# Altium schematic sheet CAN.SchDoc
size A4; SheetNumber: 2; SheetTotal: 9
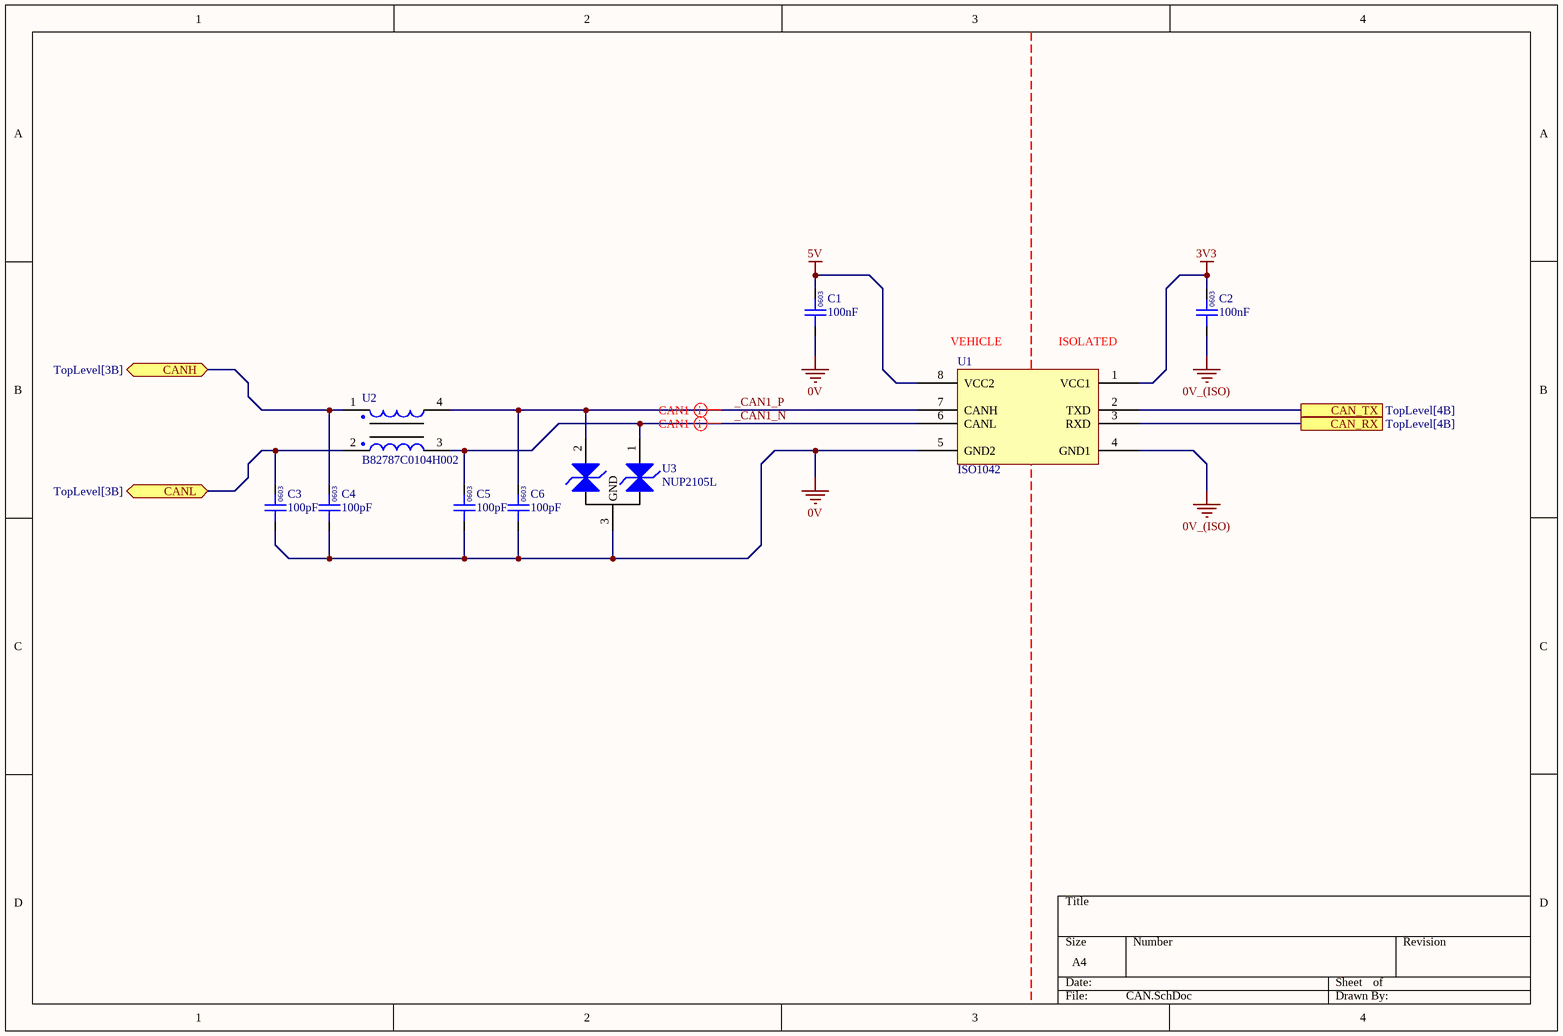
[diagram p0: CAN.SchDoc]

## Parts
C1  100nF  [0603]
C2  100nF  [0603]
C3  100pF  [0603]
C4  100pF  [0603]
C5  100pF  [0603]
C6  100pF  [0603]
U1  ISO1042  [TI-SOIC-8]
U2  B82787C0104H002  [TDK 4-PC Pad]
U3  NUP2105L  [ON SOT-23]

## Ports
CAN_RX (see TopLevel[4B]), CAN_TX (see TopLevel[4B]), CANH (bidir, see TopLevel[3B]), CANL (bidir, see TopLevel[3B])

## Nets
0V: C1.1 C3.1 C4.1 C5.1 C6.1 U1.5(GND2) U3.3(GND)
0V_(ISO): C2.1 U1.4(GND1)
3V3: C2.2 U1.1(VCC1)
5V: C1.2 U1.8(VCC2)
_CAN1_N: C5.2 U1.6(CANL) U2.3 U3.1(CAN_H)
_CAN1_P: C6.2 U1.7(CANH) U2.4 U3.2(CAN_L)
CAN_RX: U1.3(RXD) ; port CAN_RX
CAN_TX: U1.2(TXD) ; port CAN_TX
CANH: C4.2 U2.1 ; port CANH
CANL: C3.2 U2.2 ; port CANL

## Layout directives
differential pair: _CAN1_N, _CAN1_P

## Notes on the sheet
- (near U1) VEHICLE
- (near U1) ISOLATED
- (in symbol GCM188L81H104KA57D) 0603
- (in symbol GRM1885C1H101JA01D) 0603

## Library data of the parts
C1 C2 = GCM188L81H104KA57D: Manufacturer: muRata; Rated Voltage: 50V; Tolerance: ±10%; Material: MLCC; Temperature Rating: X8L; Part Number: GCM188L81H104KA57D; Value: 100nF; Digikey Part Number: 490-6049-1-ND
C3-C6 = GRM1885C1H101JA01D: Manufacturer: Murata Electronics; Rated Voltage: 50V; Tolerance: ±5%; Material: MLCC; Temperature Rating: C0G, NP0; Part Number: GRM1885C1H101JA01D; Value: 100pF; Digikey Part Number: 490-1427-1-ND
U1 = ISO1042: IC CAN TRANSCEIVER 1/1 8SOIC; Manufacturer: Texas Instruments; Part Number: ISO1042; Digikey Part Number: 296-ISO1042BQDWVQ1-ND
U2 = B82787C0104H002: Manufacturer: EPCOS (TDK); Value: 100µH @ 100kHz; Impedance: 5.8 kOhms @ 10MHz; Rated Current: 150mA; Part Number: B82787C0104H002; Material: Wirewound; Digikey Part Number: 495-4598-1-ND
U3 = NUP2105L: Dual Line CAN Bus Protector; Manufacturer: ON Semiconductor; Part Number: NUP2105L; Digikey Part Number: NUP2105LT1GOSCT-ND; Digikey Link: https://www.digikey.com/product-detail/en/on-semiconductor/NUP2105LT1G/NUP2105LT1GOSCT-ND/1485001